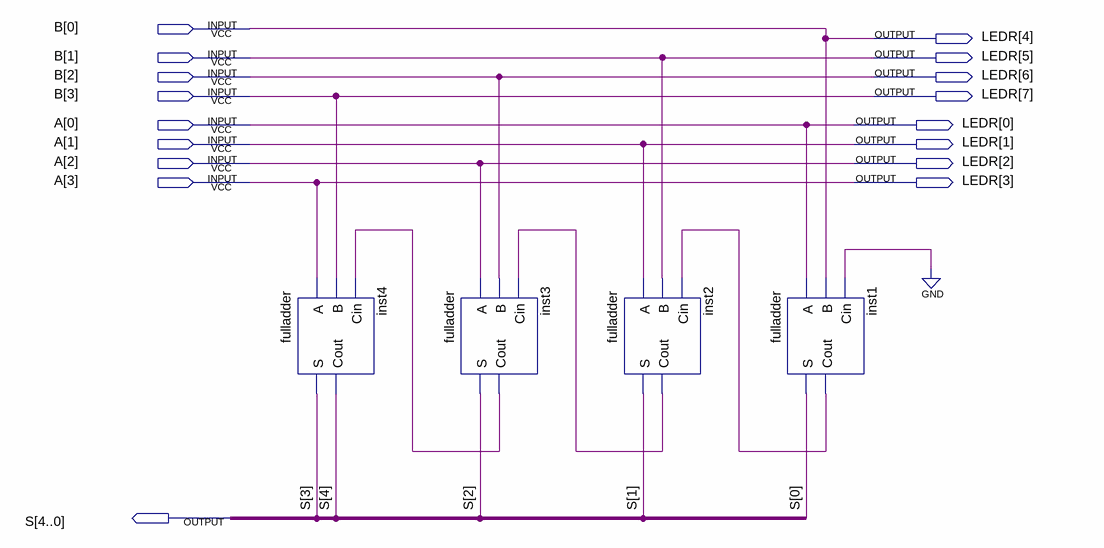
[diagram p0: schematic sheet]
// Quartus schematic FA4bits.bdf as structural Verilog: 4 symbols, 17 pins
module FA4bits (
  input  [3:0] B,
  input  [3:0] A,
  output [7:0] LEDR,
  output [4:0] S
);

  wire inst1_cout, inst2_cout, inst3_cout;

  fulladder inst4 (.A(A[3]), .B(B[3]), .Cin(inst3_cout), .Cout(S[4]), .S(S[3]));
  fulladder inst3 (.A(A[2]), .B(B[2]), .Cin(inst2_cout), .Cout(inst3_cout), .S(S[2]));
  fulladder inst2 (.A(A[1]), .B(B[1]), .Cin(inst1_cout), .Cout(inst2_cout), .S(S[1]));
  fulladder inst1 (.A(A[0]), .B(B[0]), .Cin(1'b0), .Cout(inst1_cout), .S(S[0]));

  assign LEDR = {B, A};
endmodule
